# EAGLE design OnOnfre_plug_dev_nao_usar (EAGLE 8.6.0)
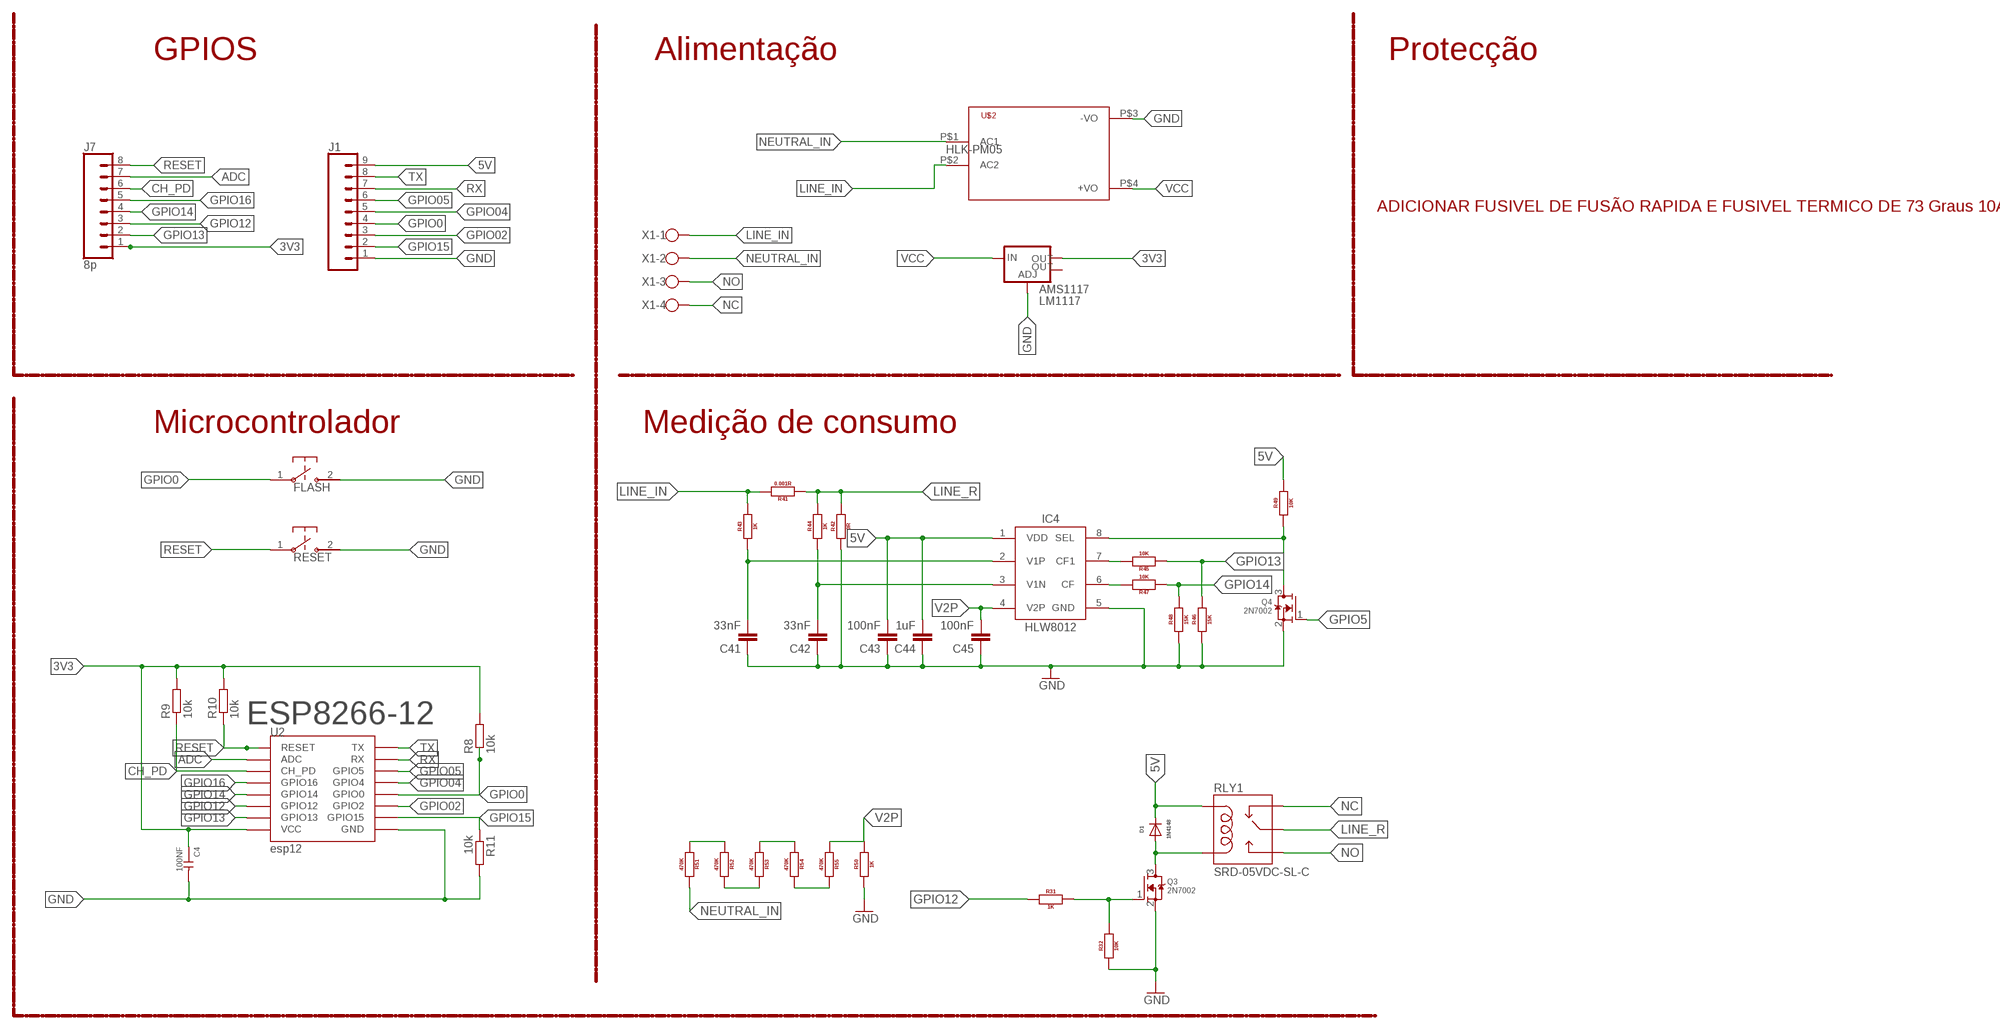
[diagram p0: schematic, sheet 1]

## Parts
AMS1117  LM1117  V_REG_LM1117SOT223  [SOT223]
C4  100NF  CERAMIC-1NF-1KV-10%-X7R(1206)  [C1206]
C41  33nF  C-EU0805  [0805]
C42  33nF  C-EU0805  [0805]
C43  100nF  C-EU0805  [0805]
C44  1uF  C-EU0805  [0805]
C45  100nF  C-EU0805  [0805]
D1  1N4148  DIODE  [SOD80]
FLASH  B3U-1000P-2P-SMD  B3U-1000P  [B3U-1000P]
IC4  HLW8012  [SOP8]
J1  CONN_09  [1X09]
J7  8p  CONN_08"  [1X08]
Q3  2N7002  MOSFET-NREFLOW  [SOT23]
Q4  2N7002  MOSFET-NREFLOW  [SOT23]
R8  10k  R-EU_R0603  [R0603]
R9  10k  R-EU_R0603  [R0603]
R10  10k  R-EU_R0603  [R0603]
R11  10k  R-EU_R0603  [R0603]
R31  1K  RESISTOR0805  [0805]
R32  10K  RESISTOR0805  [0805]
R41  0.001R  RESISTOR2512  [2512]
R42  0R  RESISTOR1206  [1206]
R43  1K  RESISTOR0805  [0805]
R44  1K  RESISTOR0805  [0805]
R45  10K  RESISTOR0805  [0805]
R46  15K  RESISTOR0805  [0805]
R47  10K  RESISTOR0805  [0805]
R48  15K  RESISTOR0805  [0805]
R49  10K  RESISTOR0805  [0805]
R50  1K  RESISTOR0805  [0805]
R51  470K  RESISTOR0805  [0805]
R52  470K  RESISTOR0805  [0805]
R53  470K  RESISTOR0805  [0805]
R54  470K  RESISTOR0805  [0805]
R55  470K  RESISTOR0805  [0805]
RESET  B3U-1000P-2P-SMD  B3U-1000P  [B3U-1000P]
RLY1  SRD-05VDC-SL-C  RELAYSONGLE  [SRD-5VDC-SL-C]
U2  esp12  ESP12SMD  [ESP12-SMD]
U$2  HKLPM01  [HKLPM01]
X1  W237-4  [W237-4]

## Nets
3V3: AMS1117.2(OUT) C4.1 J7.1 R8.2 R9.2 R10.2 U2.VCC
5V: C43.2 C44.2 D1.2(C) IC4.1(VDD) J1.9 R49.2 RLY1.COIL1
ADC: J7.7 U2.ADC
CH_PD: J7.6 R9.1 U2.CH_PD
GND: AMS1117.1(ADJ) C4.2 C41.1 C42.1 C43.1 C44.1 C45.1 FLASH.2 IC4.5(GND) J1.1 Q3.2(S) Q4.2(S) R11.2 R32.1 R42.1 R46.1 R48.1 R50.1 RESET.2 U2.GND U$2.P$3(-VO)
GPIO0: FLASH.1 J1.4 R8.1 U2.GPIO0
GPIO02: J1.3 U2.GPIO2
GPIO04: J1.5 U2.GPIO4
GPIO05: J1.6 U2.GPIO5
GPIO5: Q4.1(G)
GPIO12: J7.3 R31.1 U2.GPIO12
GPIO13: J7.2 R45.1 R46.2 U2.GPIO13
GPIO14: J7.4 R47.1 R48.2 U2.GPIO14
GPIO15: J1.2 R11.1 U2.GPIO15
GPIO16: J7.5 U2.GPIO16
LINE_IN: R41.2 R43.2 U$2.P$2(AC2) X1.1
LINE_R: R41.1 R42.2 R44.2 RLY1.COMMON(MAIN)
N$2: IC4.6(CF) R47.2
N$4: D1.1(A) Q3.3(D) RLY1.COIL2
N$5: Q3.1(G) R31.2 R32.2
N$6: R51.1 R52.1
N$8: R52.2 R53.2
N$10: IC4.8(SEL) Q4.3(D) R49.1
N$11: IC4.7(CF1) R45.2
N$12 [220V]: C41.2 IC4.2(V1P) R43.1
N$14: C42.2 IC4.3(V1N) R44.1
N$15: R53.1 R54.1
N$16: R54.2 R55.2
NC: RLY1.CLOSED(NC) X1.4
NEUTRAL_IN [220V]: R51.2 U$2.P$1(AC1) X1.2
NO: RLY1.OPEN(NO) X1.3
RESET: J7.8 R10.1 RESET.1 U2.RESET
RX: J1.7 U2.RXD0(RX)
TX: J1.8 U2.TXD0(TX)
V2P: C45.2 IC4.4(V2P) R50.2 R55.1
VCC: AMS1117.3(IN) U$2.P$4(+VO)
Unconnected: AMS1117.4(OUT)

## Notes on the sheet
- GPIOS | Alimentação | Protecção
- HLK-PM05
- ADICIONAR FUSIVEL DE FUSÃO RAPIDA E FUSIVEL TERMICO DE 73 Graus 10A
- Microcontrolador | Medição de consumo
- ESP8266-12

## Library data of the parts
AMS1117 = SparkFun-IC-Power:V_REG_LM1117: Voltage Regulator LM1117 Standard adjustable voltage regulator but in SMD form. Spark Fun Electronics SKU : COM-00595; PROD_ID: VREG-08170
C4 = Seeed-Capacitor:CERAMIC-1NF-1KV-10%-X7R?(1206): 302010189; MPN: CC1206KKX7RCBB102; VALUE: 1NF
C41-C45 = xose:C-EU: CAPACITOR, European symbol
D1 = xose:DIODE
FLASH RESET = switches:B3U: Switch; DIGIKEY: SW1020CT-ND; MANUFACTURER: Omron; MPN: B3U-1000P
IC4 = xose:HLW8012
J1 = SparkFun-Connectors:CONN_09: Multi connection point. Often used as Generic Header-pin footprint for 0.1 inch spaced/style header connections On any of the 0.1 inch spaced packages, you can populate with these: Break Away Headers - Straight <https://www.sparkfun.com/products/116> (PRT-00116) Break Away Male Headers - Right Angle <https://www.sparkfun.com/products/553> (PRT-00553) Female Headers <https://www.sparkfun.com/products/115> (PRT-00115) Break Away Headers - Machine Pin <https://www.sparkfun.com/products/117> (PRT-00117) Break Away Female Headers - Swiss Machine Pin <https://www.sparkfun.com/products/743> (PRT-00743) For SCREWTERMINALS and SPRING TERMINALS visit here: Screw Terimnals on SparkFun.com <https://www.sparkfun.com/search/results?term=Screw+Terminals> (5mm/3.5mm/2.54mm spacing) This device is also useful as a general connection point to wire up your design to another part of your project. Our various solder wires solder well into these plated through hole pads. Hook-Up Wire - Assortment (Stranded, 22 AWG) <https://www.sparkfun.com/products/11375> (PRT-11375) Hook-Up Wire - Assortment (Solid Core, 22 AWG) <https://www.sparkfun.com/products/11367> (PRT-11367) View the entire wire category on our website here <https://www.sparkfun.com/categories/141> Special notes: Molex polarized connector foot print use with SKU : PRT-08231 with associated crimp pins and housings. 1MM SMD Version SKU: PRT-10208 NOTES ON THE VARIANTS LOCK and LOCK_LONGPADS... This footprint was designed to help hold the alignment of a through-hole component (i.e. 6-pin header) while soldering it into place. You may notice that each hole has been shifted either up or down by 0.005 of an inch from it's more standard position (which is a perfectly straight line). This slight alteration caused the pins (the squares in the middle) to touch the edges of the holes. Because they are alternating, it causes a "brace" to hold the component in place. 0.005 has proven to be the perfect amount of "off-center" position when using our standard breakaway headers. Although looks a little odd when you look at the bare footprint, once you have a header in there, the alteration is very hard to notice. Also,if you push a header all the way into place, it is covered up entirely on the bottom side.
J7 = SparkFun-Connectors:CONN_08: Multi connection point. Often used as Generic Header-pin footprint for 0.1 inch spaced/style header connections On any of the 0.1 inch spaced packages, you can populate with these: Break Away Headers - Straight <https://www.sparkfun.com/products/116> (PRT-00116) Break Away Male Headers - Right Angle <https://www.sparkfun.com/products/553> (PRT-00553) Female Headers <https://www.sparkfun.com/products/115> (PRT-00115) Break Away Headers - Machine Pin <https://www.sparkfun.com/products/117> (PRT-00117) Break Away Female Headers - Swiss Machine Pin <https://www.sparkfun.com/products/743> (PRT-00743) Arduino Stackable Header - 8 Pin <https://www.sparkfun.com/products/9279> (PRT-09279) For SCREWTERMINALS and SPRING TERMINALS visit here: Screw Terimnals on SparkFun.com <https://www.sparkfun.com/search/results?term=Screw+Terminals> (5mm/3.5mm/2.54mm spacing) This device is also useful as a general connection point to wire up your design to another part of your project. Our various solder wires solder well into these plated through hole pads. Hook-Up Wire - Assortment (Stranded, 22 AWG) <https://www.sparkfun.com/products/11375> (PRT-11375) Hook-Up Wire - Assortment (Solid Core, 22 AWG) <https://www.sparkfun.com/products/11367> (PRT-11367) View the entire wire category on our website here <https://www.sparkfun.com/categories/141> Special notes: Molex polarized connector foot print use with SKU : PRT-08231 with associated crimp pins and housings. 1MM SMD Version SKU: PRT-10208 NOTES ON THE VARIANTS LOCK and LOCK_LONGPADS... This footprint was designed to help hold the alignment of a through-hole component (i.e. 6-pin header) while soldering it into place. You may notice that each hole has been shifted either up or down by 0.005 of an inch from it's more standard position (which is a perfectly straight line). This slight alteration caused the pins (the squares in the middle) to touch the edges of the holes. Because they are alternating, it causes a "brace" to hold the component in place. 0.005 has proven to be the perfect amount of "off-center" position when using our standard breakaway headers. Although looks a little odd when you look at the bare footprint, once you have a header in there, the alteration is very hard to notice. Also,if you push a header all the way into place, it is covered up entirely on the bottom side.; PROD_ID: CONN-08438
Q3 Q4 = xose:MOSFET-N: N-Channel Mosfet 2N7002E - 60V 260mA SOT23 [Digikey: 2N7002ET1GOSTR-ND] - REEL BSH103 - 30V 850mA SOT23 [Digikey: 568-5013-1-ND]
R8-R11 = resistor:R-EU_: RESISTOR, European symbol
R31 R32 R41-R55 = xose:RESISTOR: Generic EU resistor symbol
RLY1 = Spark:RELAY: SPDT relay (COM-00101)
U2 = esp8266modules:ESP12: ESP8266 Wifi module 12
U$2 = HKLPM01:HKLPM01
X1 = con-wago-500:W237-4: WAGO SCREW CLAMP; OC_FARNELL: unknown; OC_NEWARK: unknown

## Net classes
1 220V: width 1.27 mm, clearance 2 mm

## Board
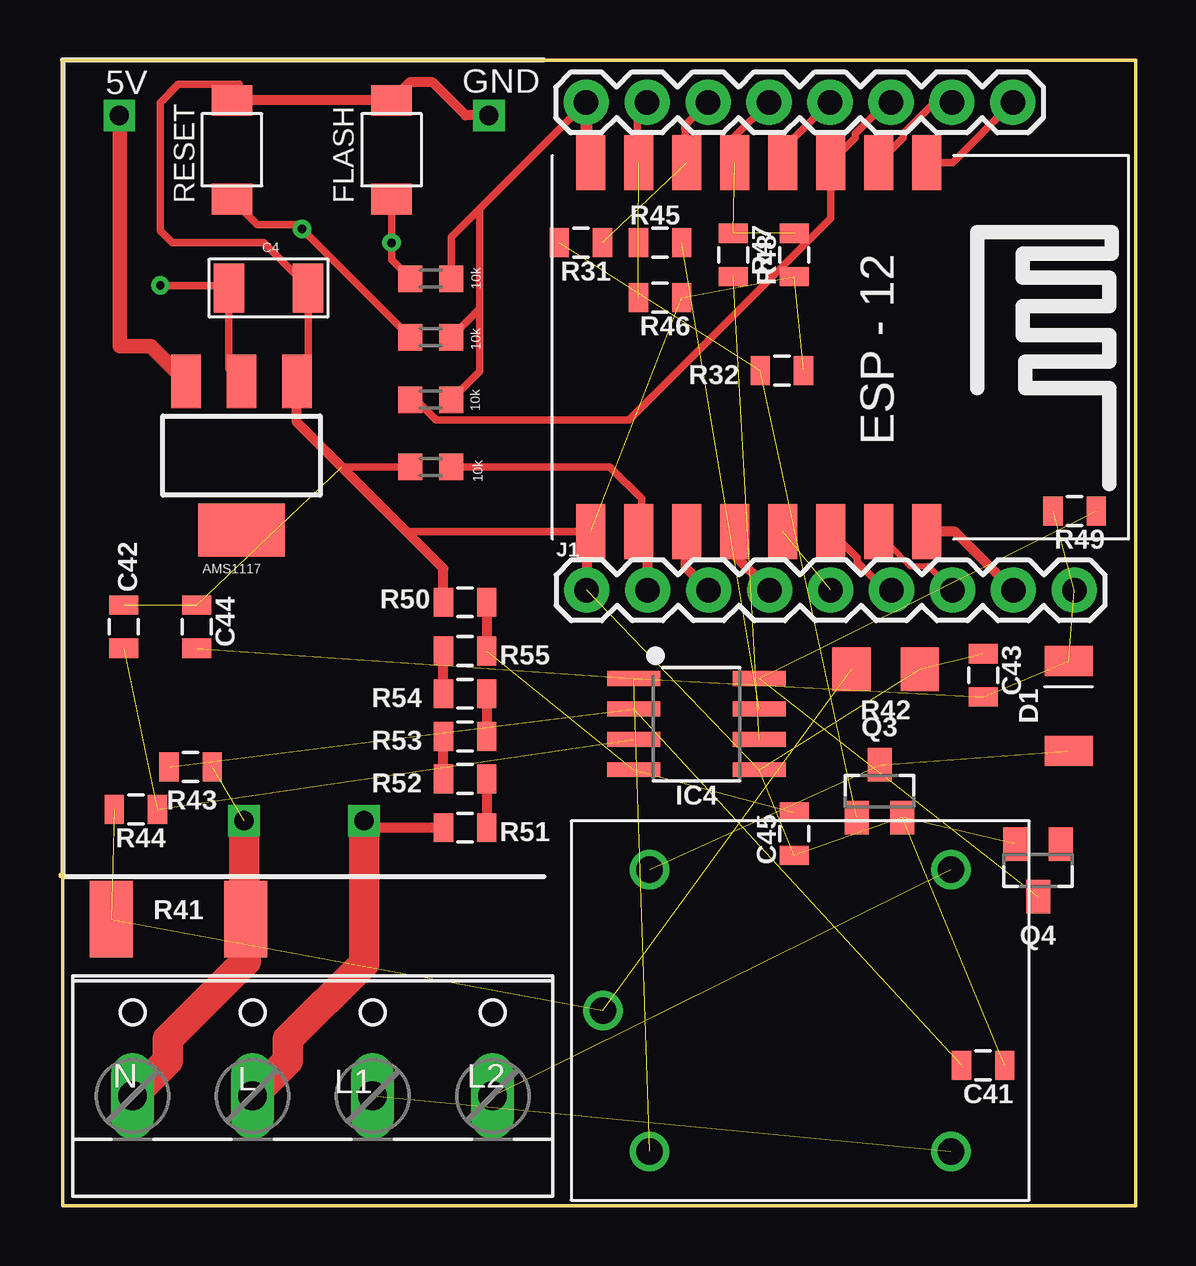
[diagram p1: board, top side]
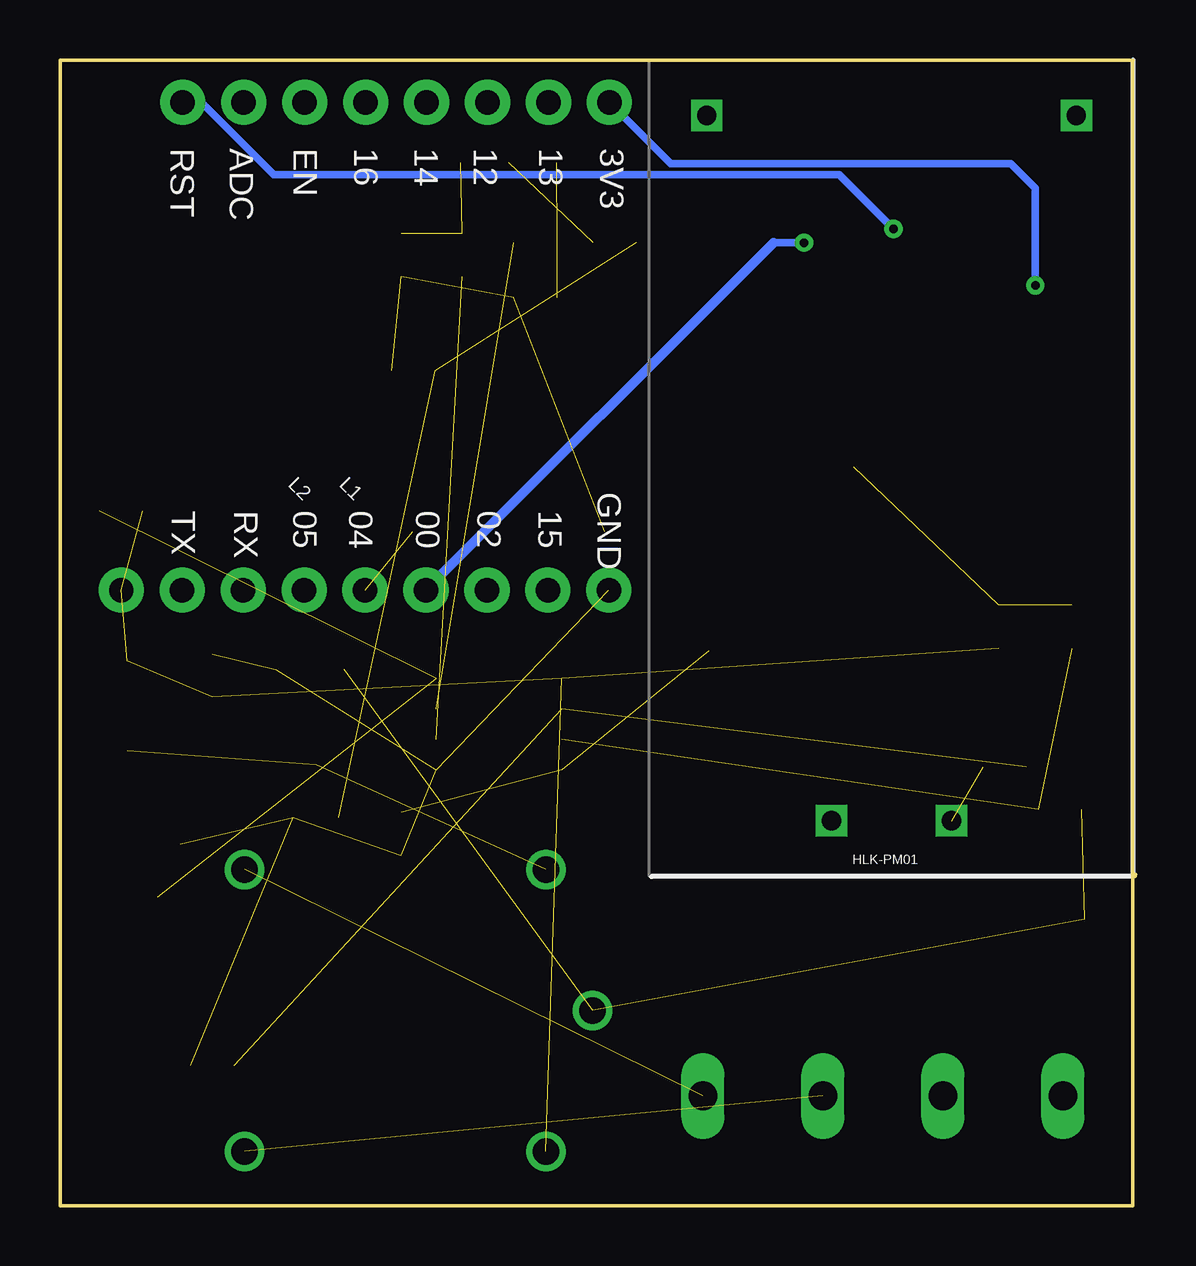
[diagram p2: board, bottom side, seen from below]

Size 44.82 x 47.75 mm. Coordinates in mm from the lower left corner, seen from the top.
Outline: 0.01,13.81 0.01,13.73 arc90 0,13.81
Outline: 0.11,47.75 0.11,0 44.82,0 44.82,47.75 0.11,47.75
Copper layers (1*16): Top 0.035mm / dielectric 1.5mm / Bottom 0.035mm
Design rules "default": minimum track width 6mil, minimum drill 0.35mm, track to track 6mil, track to pad 6mil, pad to pad 6mil, via to via 6mil, smd to smd 6mil, copper to edge 40mil, drill to drill 6mil, minimum pad ring 10mil, minimum via ring 8mil, stop-mask expansion 4mil, vias tented up to drill 0mil, thermal gap 10mil

### Footprints (pad centres in the part's own frame; a part is rotated, then mirrored left to right if it is on the bottom)
SOT223 = smd 1.219 x 2.235: 1 -2.311,-3.099; 2 0,-3.099; 3 2.311,-3.099 | smd 3.6 x 2.2: 4 0,3.099
C1206 = smd 1.27 x 2.032: 1 -1.651,0; 2 1.651,0
0805 = smd 0.8 x 1.2: 1 -0.9,0; 2 0.9,0
SOD80 = smd 1.25 x 2: 1 -1.872,0; 2 1.872,0
B3U-1000P = smd 1.283 x 1.7: 1 -2.056,0; 2 2.056,0
SOP8 = smd 0.61 x 2.21: 1 0.381,-0.838; 2 1.651,-0.838; 3 2.921,-0.838; 4 4.191,-0.838; 5 4.191,4.394; 6 2.921,4.394; 7 1.651,4.394; 8 0.381,4.394
1X09 = drill 1.016 pad 1.88: 1 0,0; 2 2.54,0; 3 5.08,0; 4 7.62,0; 5 10.16,0; 6 12.7,0; 7 15.24,0; 8 17.78,0; 9 20.32,0
1X08 = drill 1.016 pad 1.88: 1 0,0; 2 2.54,0; 3 5.08,0; 4 7.62,0; 5 10.16,0; 6 12.7,0; 7 15.24,0; 8 17.78,0
SOT23 = smd 1 x 1.4: 1 -0.95,-1.1; 2 0.95,-1.1; 3 0,1.1
R0603 = smd 1 x 1.1: 1 -0.85,0; 2 0.85,0
2512 = smd 1.8 x 3.2: 1 -2.8,0; 2 2.8,0
1206 = smd 1.6 x 1.803: 1 -1.422,0; 2 1.422,0
SRD-5VDC-SL-C = drill 1.1: CLOSED -6.275,-5.875; COIL1 6.275,5.875; COIL2 6.275,-5.875; COMMON 8.225,0; OPEN -6.275,5.875
ESP12-SMD = smd 2.286 x 1.2: ADC -7.792,3.8; CH_PD -7.792,1.8; GND 7.592,-8.2; GPIO0 7.592,-2.2; GPIO2 7.592,-4.2; GPIO4 7.592,-0.2; GPIO5 7.592,1.8; GPIO12 -7.792,-4.2; GPIO13 -7.792,-6.2; GPIO14 -7.792,-2.2; GPIO15 7.592,-6.2; GPIO16 -7.792,-0.2; RESET -7.792,5.8; RXD0 7.592,3.8; TXD0 7.592,5.8; VCC -7.792,-8.2
HKLPM01 = drill 0.8 square: P$1 -14.7,2.5; P$2 -14.7,-2.5; P$3 14.7,7.7; P$4 14.7,-7.7
W237-4 = drill 1.194 long: 1 -7.5,-1.27; 2 -2.5,-1.27; 3 2.5,-1.27; 4 7.5,-1.27

### Placement (x,y rotation side)
AMS1117  7.56,31.26 180 top
C4  8.69,38.25 0 top
C41  38.47,5.84 180 top
C42  2.65,24.13 270 top
C43  38.47,22.1 270 top
C44  5.7,24.13 270 top
C45  30.59,15.49 90 top
D1  42.02,20.83 90 top
FLASH  13.81,44.01 90 top
IC4  24.75,22.35 270 top
J1  21.95,25.65 0 top
J7  21.92,45.99 0 top
Q3  34.15,17.27 0 top
Q4  40.75,13.97 180 top
R8  15.45,38.63 0 top
R9  15.45,33.59 0 top
R10  15.45,36.19 0 top
R11  15.45,30.79 180 top
R31  21.7,40.13 180 top
R32  30.08,34.8 180 top
R41  4.94,11.94 0 top
R42  34.4,22.35 180 top
R43  5.45,18.29 0 top
R44  3.16,16.51 180 top
R45  25,40.13 0 top
R46  25,37.85 180 top
R47  28.05,39.62 270 top
R48  30.59,39.62 90 top
R49  42.28,28.96 180 top
R50  16.88,25.15 0 top
R51  16.88,15.75 180 top
R52  16.88,17.78 180 top
R53  16.88,19.56 180 top
R54  16.88,21.34 180 top
R55  16.88,23.11 180 top
RESET  7.17,44.01 90 top
RLY1  30.85,8.13 180 top
U2  30.32,35.68 270 top
U$2  10.17,30.74 90 bottom
X1  10.53,5.84 0 top

### Tracks (layer width: path | path; a pad name or v marks a point on that pad's centre or on a via)
3V3  (via drill 0.35)
  Top 0.305: AMS1117.2 7.04,34.88 C4.1 6.93,38.35 v4.18,38.35 | R8.2 16.3,40.37 17.49,41.55 | 17.49,41.55 J7.1 | R10.2 17.49,37.38 | 17.49,37.38 17.49,41.55 | R9.2 17.49,34.77 17.49,37.38
  Top 0.508: J7.1 21.92,43.53 U2.VCC
  Bottom 0.305: J7.1 19.37,43.43 5.19,43.43 4.18,42.42 v4.18,38.35
5V  (6 unrouted)
ADC
  Top 0.305: U2.ADC 35.13,44.51 35.13,44.68 36.44,45.99 J7.7
CH_PD
  Top 0.305: J7.6 34.44,45.99 33.13,44.68 33.13,44.51 U2.CH_PD 32.12,41.15 23.7,32.73 15.68,32.73 14.82,33.59 R9.1
GND  (12 unrouted)
  Top 0.305: R11.2 11.74,30.79 | 11.74,30.79 9.87,32.66 | AMS1117.1 10.34,34.82 C4.2 10.34,38.29 8.49,40.13 4.68,40.13 4.18,40.64 4.18,45.97 4.94,46.74 7.48,46.74 7.48,46.57 7.99,46.06 | U2.GND 14.44,28.09 11.74,30.79
  Top 0.406: U$2.P$3 16.9,45.44 15.52,46.82 14.57,46.82 FLASH.2 7.99,46.06 RESET.2 | U2.GND 21.95,27.92 J1.1 | R50.1 15.98,26.55 9.87,32.66 AMS1117.1
GPIO0  (via drill 0.35)
  Top 0.305: 28.04,27.18 28.06,27.45 U2.GPIO0 | R8.1 13.81,39.42 v13.81,40.13 FLASH.1
  Top 0.406: J1.4 28.06,27.15 28.06,27.45
  Bottom 0.305: v13.81,40.13 15.08,40.13
  Bottom 0.406: 15.08,40.13 J1.4
GPIO02
  Top 0.305: 26.04,26.64 26.08,27.43 U2.GPIO2
  Top 0.406: J1.3 26.08,26.59 26.08,27.43
GPIO04  (1 unrouted)
GPIO05
  Top 0.305: U2.GPIO5 33.22,26.99 33.22,26.82 34.39,25.65 J1.6
GPIO12  (1 unrouted)
  Top 0.305: U2.GPIO12 26.04,45.02 J7.3
GPIO13  (2 unrouted)
  Top 0.305: U2.GPIO13 24.04,45.56 J7.2
GPIO14  (2 unrouted)
  Top 0.305: U2.GPIO14 28.04,44.48 J7.4
GPIO15
  Top 0.305: R11.1 22.91,30.79 24.24,29.46 24.24,28.45 24.49,28.2 24.49,27.72 24.49,27.43 | U2.GPIO15
  Top 0.406: J1.2 24.49,27.72 U2.GPIO15
GPIO16
  Top 0.305: U2.GPIO16 30.04,43.94 J7.5
LINE_IN  (1 unrouted)
  Top 1.27: U$2.P$2 7.67,12.01 R41.2 7.74,10.17 4.5,6.93 4.5,6.04 X1.1
LINE_R  (3 unrouted)
N$2  (1 unrouted)
N$4  (2 unrouted)
N$5  (2 unrouted)
N$6
  Top 0.406: R52.1 R51.1
  Top 0.61: R51.1 17.78,15.98
N$8
  Top 0.406: R52.2 R53.2
N$10  (2 unrouted)
N$11  (1 unrouted)
N$12  (2 unrouted)
N$14  (2 unrouted)
N$15
  Top 0.406: R54.1 R53.1
N$16
  Top 0.406: R54.2 R55.2
NC  (1 unrouted)
NEUTRAL_IN
  Top 0.406: R51.2 12.96,15.75 U$2.P$1
  Top 0.61: 12.42,16.29 U$2.P$1
  Top 1.27: X1.2 9.5,6.04 9.5,6.93 12.67,10.1 U$2.P$1
NO  (1 unrouted)
RESET  (via drill 0.35)
  Top 0.305: RESET.1 8.23,40.89 9.9,40.89 v10.09,40.71 R10.1 | U2.RESET 37.19,43.48 J7.8
  Bottom 0.305: v10.09,40.71 12.35,42.98 35.91,42.98 38.92,45.99 J7.8
RX
  Top 0.254: U2.RXD0 34.05,28.03 34.05,27.48 34.59,27.48 35.4,26.67 36.17,26.67 J1.7
TX
  Top 0.406: J1.8 37.29,28.09 U2.TXD0
V2P  (2 unrouted)
  Top 0.406: R50.2 R55.1
VCC
  Top 0.61: U$2.P$4 2.48,45.42 2.48,35.82 3.79,35.82 AMS1117.3

### Text on the board
tNames: 5V | GND | L1 | N | L | L2
bNames: 3V3 | 13 | 12 | 14 | 16 | EN | ADC | RST | GND | L1 | L2 | 15 | 02 | 00 | 04 | 05 | RX | TX | HLK-PM01